# Altium schematic sheet ESP32_Sch.SchDoc
size A4; SheetNumber: 4; SheetTotal: 4
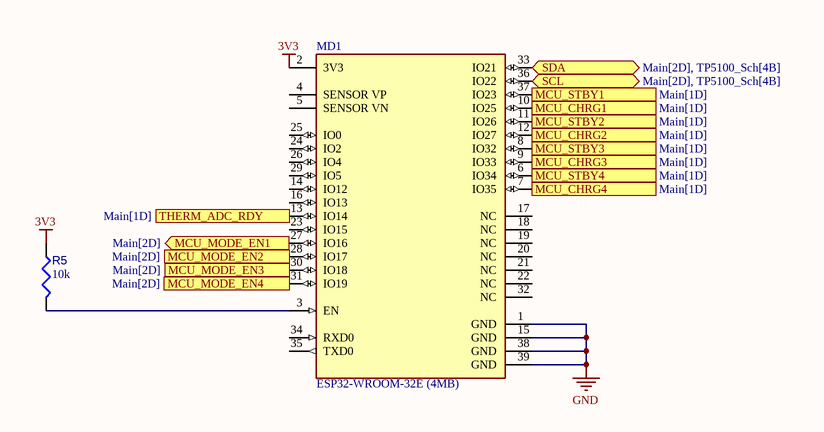
[diagram p0: ESP32_Sch.SchDoc]

## Parts
MD1  ESP32-WROOM-32E (4MB)  [FP-ESP32-WROOM-32E_4MB-MFG]
R5  value 10k  [RESC0402(1005)_L]  (hidden comment: 10KR2F)

## Ports
MCU_CHRG1 (in, see Main[1D]), MCU_CHRG2 (in, see Main[1D]), MCU_CHRG3 (in, see Main[1D]), MCU_CHRG4 (in, see Main[1D]), MCU_MODE_EN1 (out, see Main[2D]), MCU_MODE_EN2 (out, see Main[2D]), MCU_MODE_EN3 (out, see Main[2D]), MCU_MODE_EN4 (out, see Main[2D]), MCU_STBY1 (in, see Main[1D]), MCU_STBY2 (in, see Main[1D]), MCU_STBY3 (in, see Main[1D]), MCU_STBY4 (in, see Main[1D]), SCL (bidir, see Main[2D], TP5100_Sch[4B]), SDA (bidir, see Main[2D], TP5100_Sch[4B]), THERM_ADC_RDY (in, see Main[1D])

## Nets
3V3: MD1.2(3V3) R5.1
GND: MD1.1(GND) MD1.15(GND) MD1.38(GND) MD1.39(GND)
MCU_CHRG1: MD1.10(IO25) ; port MCU_CHRG1
MCU_CHRG2: MD1.12(IO27) ; port MCU_CHRG2
MCU_CHRG3: MD1.9(IO33) ; port MCU_CHRG3
MCU_CHRG4: MD1.7(IO35) ; port MCU_CHRG4
MCU_MODE_EN1: MD1.27(IO16) ; port MCU_MODE_EN1
MCU_MODE_EN2: MD1.28(IO17) ; port MCU_MODE_EN2
MCU_MODE_EN3: MD1.30(IO18) ; port MCU_MODE_EN3
MCU_MODE_EN4: MD1.31(IO19) ; port MCU_MODE_EN4
MCU_STBY1: MD1.37(IO23) ; port MCU_STBY1
MCU_STBY2: MD1.11(IO26) ; port MCU_STBY2
MCU_STBY3: MD1.8(IO32) ; port MCU_STBY3
MCU_STBY4: MD1.6(IO34) ; port MCU_STBY4
SCL: MD1.36(IO22) ; port SCL
SDA: MD1.33(IO21) ; port SDA
THERM_ADC_RDY: MD1.13(IO14) ; port THERM_ADC_RDY
NetMD1_3: MD1.3(EN) R5.2

Not connected (* = marked no-connect by the designer): MD1 4(SENSOR_VP) 5(SENSOR_VN) 14(IO12) 16(IO13) 17(NC) 18(NC) 19(NC) 20(NC) 21(NC) 22(NC) 23(IO15) 24(IO2) 25(IO0) 26(IO4) 29(IO5) 32(NC) 34(RXD0) 35(TXD0)

## Library data of the parts
MD1 = CMP-194065-000026-1: RX TXRX MOD WIFI TRACE ANT SMD
R5 = CMP-009-00066-2: 10K 0.063W 1% 0402 (1005 Metric)  SMD; Power: 63mW; Case/Package: 0402; Mounting Technology: SMT; Pins: 2; Tolerance: 1%